# EasyEDA Pro project CANBUSdataLoggerProjectFile.epro

# Schematic Schematic1
Board Name: Board1; Create Date: 2025-11-18; Page Name: P1; Project Name: carInfoDisplay; Schematic Name: Schematic1; Update Date: 2025-11-19; Company: EasyEDA.com; Page Size: A4; Version: V1.0
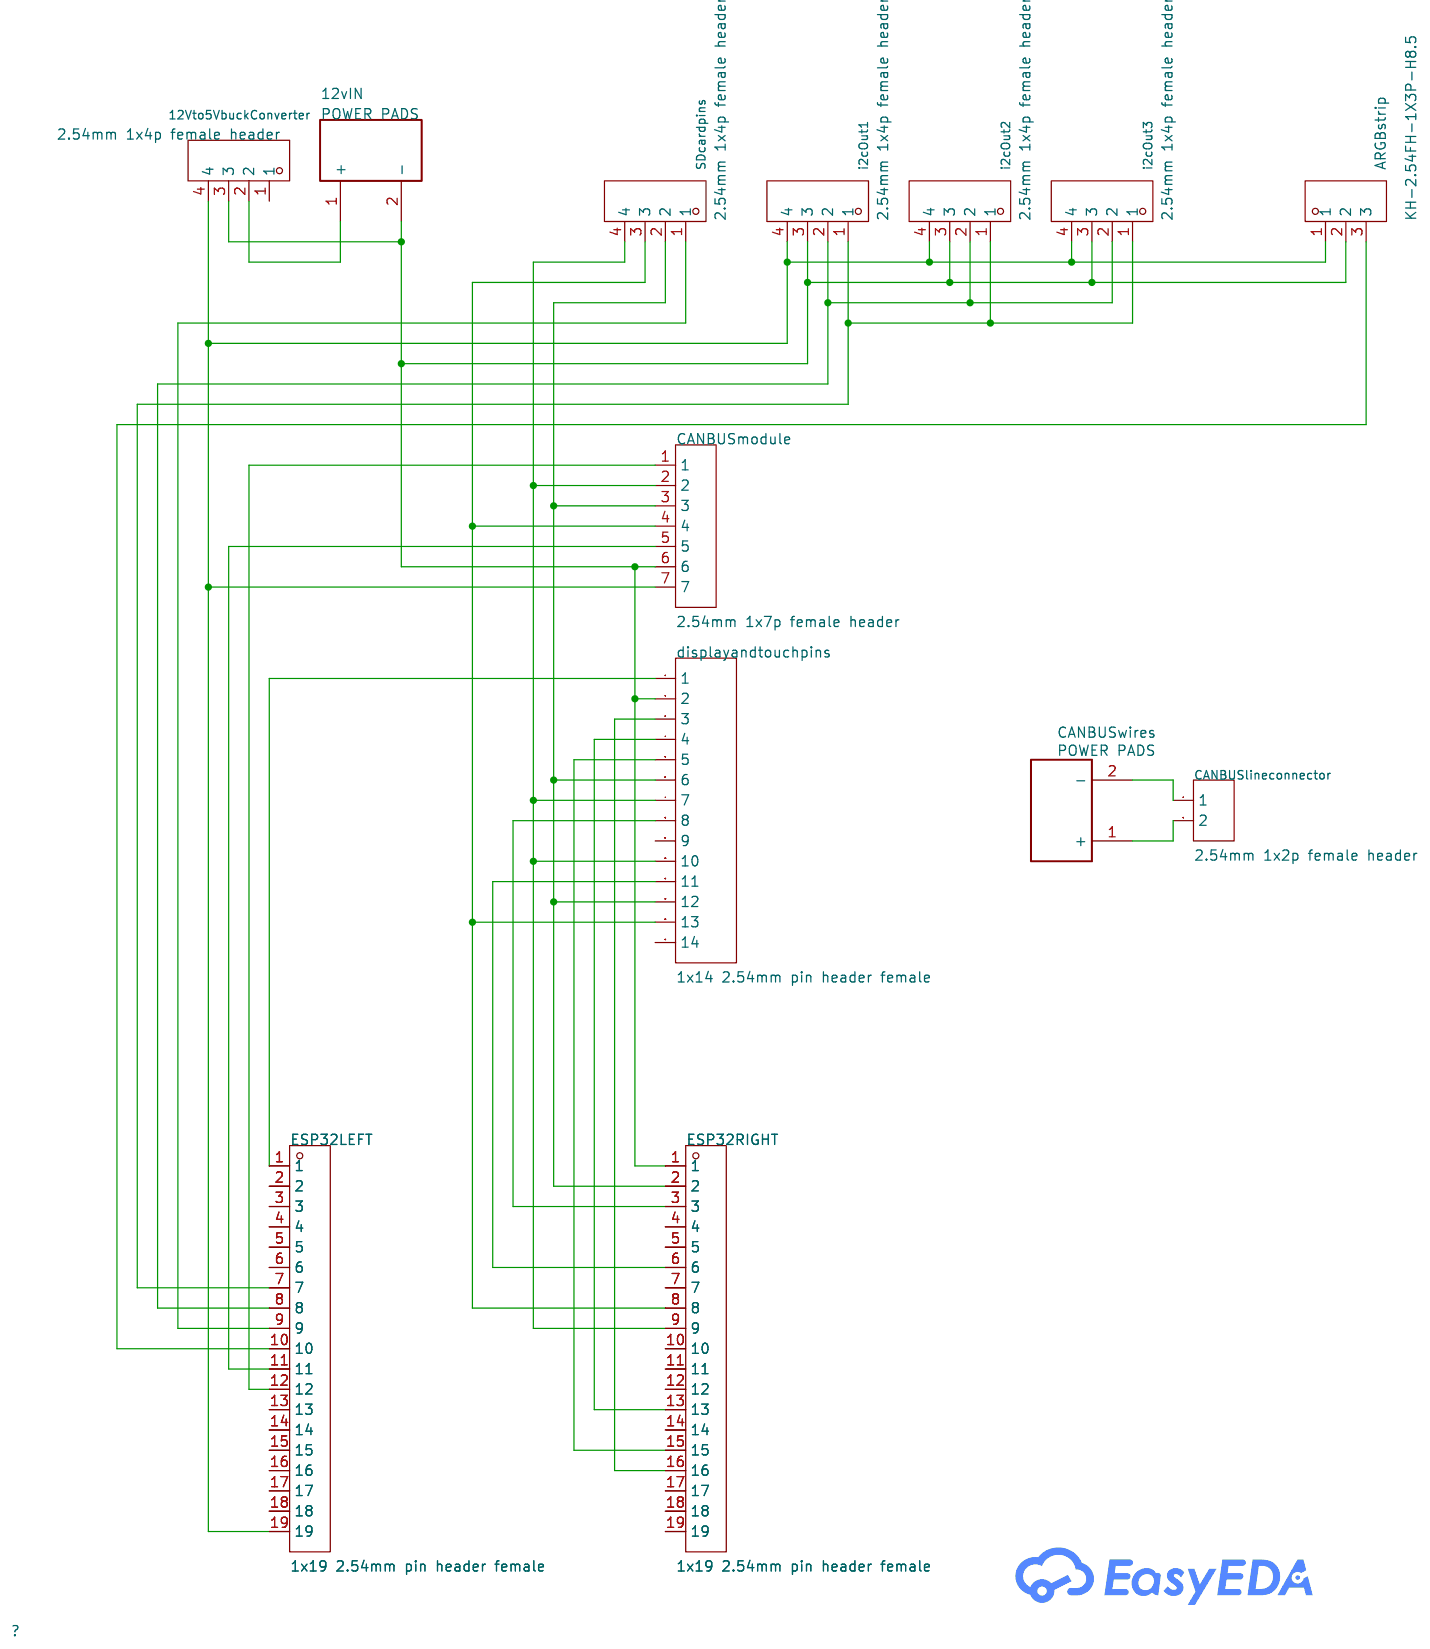
[diagram p0: schematic sheet]

## Parts
12vIN  POWER PADS  [POWERPADS]
12Vto5VbuckConverter  2.54mm 1x4p female header  [HDR-TH_4P-P2.54-V-F]
ARGBstrip  KH-2.54FH-1X3P-H8.5  [HDR-TH_3P-P2.54-V-F]
CANBUSlineconnector  2.54mm 1x2p female header  [HDR-TH_2P-P2.54-V-F]
CANBUSmodule  2.54mm 1x7p female header  [HDR-TH_7P-P2.54-V-F]
CANBUSwires  POWER PADS  [POWERPADS]
displayandtouchpins  1x14 2.54mm pin header female  [HDR-TH_14P-P2.54-V-F-1]
ESP32LEFT  1x19 2.54mm pin header female  [HDR-TH_19P-P2.54-V-F]
ESP32RIGHT  1x19 2.54mm pin header female  [HDR-TH_19P-P2.54-V-F]
i2cOut1  2.54mm 1x4p female header  [HDR-TH_4P-P2.54-V-F]
i2cOut2  2.54mm 1x4p female header  [HDR-TH_4P-P2.54-V-F]
i2cOut3  2.54mm 1x4p female header  [HDR-TH_4P-P2.54-V-F]
SDcardpins  2.54mm 1x4p female header  [HDR-TH_4P-P2.54-V-F]

## Library data of the parts
12vIN CANBUSwires = POWER PADS: Contributor: tomicode; spicePre: P
12Vto5VbuckConverter i2cOut1-i2cOut3 SDcardpins = 2.54-1*4P母: Holes Structure:1x4P Pitch:2.54mm Row Spacing:- Circular Hole / Square Hole:Square Hole Mounting Type:Through Hole Number of Rows:1 Number of Positions:4P Current Rating:3A Voltage Rating (Max):- Holes Direction:Top Insulation Height:- Contact Material:Br; LCSC Part Name: 间距:2.54mm 1x4P 直插; Supplier Part: C2718488; Manufacturer: BOOMELE(博穆精密); Supplier Footprint: 插件,P=2.54mm; JLCPCB Part Class: Extended Part; Datasheet: https://item.szlcsc.com/datasheet/2.54-1*4P%25E6%25AF%258D/2834502.html; Supplier: LCSC; Holes Structure: 1x4P; Pitch: 2.54mm; Circular Hole / Square Hole: Square Hole; Mounting Type: Through Hole; Number of Rows: 1; Number of Positions: 4P; Current Rating: 3A; Holes Direction: Top; Contact Material: Bronze; Operating Temperature: -40℃~+105℃
ARGBstrip = KH-2.54FH-1X3P-H8.5: Holes Structure:1x3P Pitch:2.54mm Row Spacing:- Circular Hole / Square Hole:Square Hole Mounting Type:Through Hole Number of Rows:1 Number of Positions:3P Current Rating:3A Voltage Rating (Max):- Holes Direction:Top Insulation Height:8.5mm Operating Tempe; LCSC Part Name: 间距:2.54mm 1x3P 直插; Supplier Part: C2932670; Manufacturer: kinghelm(金航标); Supplier Footprint: 插件,P=2.54mm; JLCPCB Part Class: Extended Part; Datasheet: https://item.szlcsc.com/datasheet/KH-2.54FH-1X3P-H8.5/3278191.html; Supplier: LCSC; Holes Structure: 1x3P; Pitch: 2.54mm; Circular Hole / Square Hole: Square Hole; Mounting Type: Through Hole; Number of Rows: 1; Number of Positions: 3P; Current Rating: 3A; Holes Direction: Top; Insulation Height: 8.5mm; Operating Temperature: -40℃~+105℃
CANBUSlineconnector = 2.54-1*2P母: Holes Structure:1x2P Pitch:2.54mm Row Spacing:- Circular Hole / Square Hole:Square Hole Mounting Type:Through Hole Number of Rows:1 Number of Positions:2P Current Rating:3A Holes Direction:Top Insulation Height:3.3mm Contact Material:- Contact Plating:- O; LCSC Part Name: 1x2P 间距:2.54mm 直插; Supplier Part: C49661; Manufacturer: BOOMELE(博穆精密); Supplier Footprint: 插件,P=2.54mm; JLCPCB Part Class: Extended Part; Datasheet: https://item.szlcsc.com/datasheet/2.54-1*2P%25E6%25AF%258D/50669.html; Supplier: LCSC; Holes Structure: 1x2P; Pitch: 2.54mm; Circular Hole / Square Hole: Square Hole; Mounting Type: Through Hole; Number of Rows: 1; Number of Positions: 2P; Current Rating: 3A; Holes Direction: Top; Insulation Height: 3.3mm; Operating Temperature: -40℃~+105℃
CANBUSmodule = HC-PM254-8.5H-1x7PZ: Holes Structure:1x7P Pitch:2.54mm Row Spacing:- Circular Hole / Square Hole:Square Hole Mounting Type:Through Hole Number of Rows:1 Number of Positions:7P Current Rating:3A Voltage Rating (Max):- Holes Direction:Top Insulation Height:8.5mm Contact Materia; LCSC Part Name: 间距2.54mm 1x7Pin 直插 PC3.0 H8.5; Supplier Part: C22373893; Manufacturer: HC(虹成电子); Supplier Footprint: 插件,P=2.54mm; JLCPCB Part Class: Extended Part; Datasheet: https://item.szlcsc.com/datasheet/HC-PM254-8.5H-1x7PZ/23870229.html; Supplier: LCSC; Holes Structure: 1x7P; Pitch: 2.54mm; Circular Hole / Square Hole: Square Hole; Mounting Type: Through Hole; Number of Rows: 1; Number of Positions: 7P; Current Rating: 3A; Holes Direction: Top; Insulation Height: 8.5mm; Contact Material: Brass; Contact Plating: Gold; Operating Temperature: -40℃~+105℃; PIN Length: 3mm
displayandtouchpins = 2.54-1*14P母: Holes Structure:1x14P Pitch:2.54mm Row Spacing:- Circular Hole / Square Hole:Square Hole Mounting Type:Through Hole Number of Rows:1 Number of Positions:14P Current Rating:3A Voltage Rating (Max):- Holes Direction:Top Insulation Height:3.3mm Contact Mater; LCSC Part Name: 1x14P 间距:2.54mm 直插; Supplier Part: C52711; Manufacturer: BOOMELE(博穆精密); Supplier Footprint: 插件,P=2.54mm; JLCPCB Part Class: Extended Part; Datasheet: https://item.szlcsc.com/datasheet/2.54-1*14P%25E6%25AF%258D/53725.html; Supplier: LCSC; Holes Structure: 1x14P; Pitch: 2.54mm; Circular Hole / Square Hole: Square Hole; Mounting Type: Through Hole; Number of Rows: 1; Number of Positions: 14P; Current Rating: 3A; Holes Direction: Top; Insulation Height: 3.3mm; Operating Temperature: -40℃~+105℃
ESP32LEFT ESP32RIGHT = KH-2.54FH-1X19P-H8.5: Holes Structure:1x19P Pitch:2.54mm Row Spacing:- Circular Hole / Square Hole:Square Hole Mounting Type:Through Hole Number of Rows:1 Number of Positions:19P Current Rating:3A Voltage Rating (Max):- Holes Direction:Top Insulation Height:8.5mm Operating Tem; LCSC Part Name: 间距:2.54mm 1x19P 直插; Supplier Part: C2932678; Manufacturer: kinghelm(金航标); Supplier Footprint: 插件,P=2.54mm; JLCPCB Part Class: Extended Part; Datasheet: https://item.szlcsc.com/datasheet/KH-2.54FH-1X19P-H8.5/3278199.html; Supplier: LCSC; Holes Structure: 1x19P; Pitch: 2.54mm; Circular Hole / Square Hole: Square Hole; Mounting Type: Through Hole; Number of Rows: 1; Number of Positions: 19P; Current Rating: 3A; Holes Direction: Top; Insulation Height: 8.5mm; Operating Temperature: -40℃~+105℃

## Nets
$1N1624: displayandtouchpins.1 ESP32LEFT.1
$1N1629: 12vIN.2(-) 12Vto5VbuckConverter.3 ARGBstrip.2 CANBUSmodule.6 displayandtouchpins.2 ESP32RIGHT.1 i2cOut1.3 i2cOut2.3 i2cOut3.3
$1N1636: displayandtouchpins.3 ESP32RIGHT.16
$1N1643: displayandtouchpins.4 ESP32RIGHT.13
$1N1650: displayandtouchpins.5 ESP32RIGHT.15
$1N1657: CANBUSmodule.3 displayandtouchpins.6 displayandtouchpins.12 ESP32RIGHT.2 SDcardpins.2
$1N1663: CANBUSmodule.2 displayandtouchpins.7 displayandtouchpins.10 ESP32RIGHT.9 SDcardpins.4
$1N1670: displayandtouchpins.8 ESP32RIGHT.3
$1N1691: displayandtouchpins.11 ESP32RIGHT.6
$1N1709: CANBUSmodule.4 displayandtouchpins.13 ESP32RIGHT.8 SDcardpins.3
$1N1824: CANBUSmodule.1 ESP32LEFT.12
$1N1870: CANBUSmodule.5 ESP32LEFT.11
$1N1888: 12Vto5VbuckConverter.4 ARGBstrip.1 CANBUSmodule.7 ESP32LEFT.19 i2cOut1.4 i2cOut2.4 i2cOut3.4
$1N1979: CANBUSlineconnector.2 CANBUSwires.1(+)
$1N1984: CANBUSlineconnector.1 CANBUSwires.2(-)
$1N2085: 12vIN.1(+) 12Vto5VbuckConverter.2
$1N2121: ESP32LEFT.9 SDcardpins.1
$1N2367: ESP32LEFT.8 i2cOut1.2 i2cOut2.2 i2cOut3.2
$1N2374: ESP32LEFT.7 i2cOut1.1 i2cOut2.1 i2cOut3.1
$1N3081: ARGBstrip.3 ESP32LEFT.10

Not connected (* = marked no-connect by the designer): 12Vto5VbuckConverter 1; displayandtouchpins 9 14; ESP32LEFT 2 3 4 5 6 13 14 15 16 17 18; ESP32RIGHT 4 5 7 10 11 12 14 17 18 19

# Board PCB1
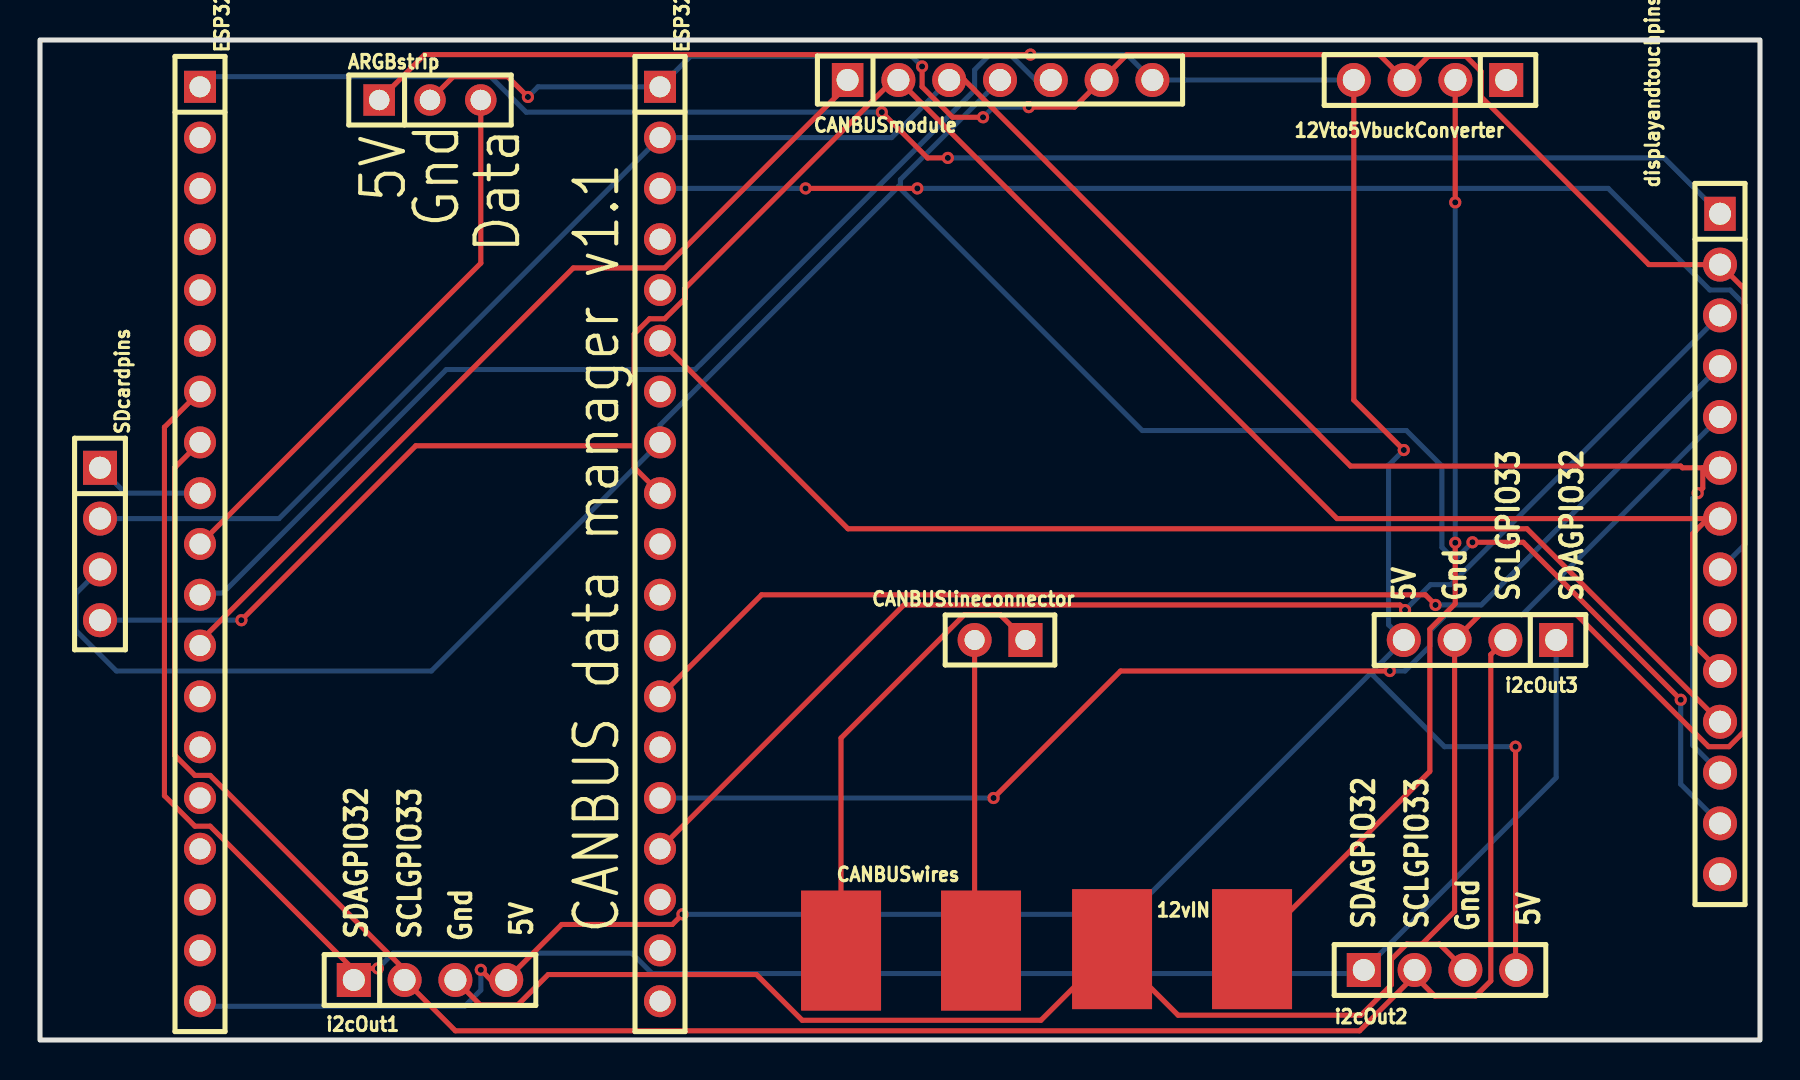
[diagram p1: board, top side]
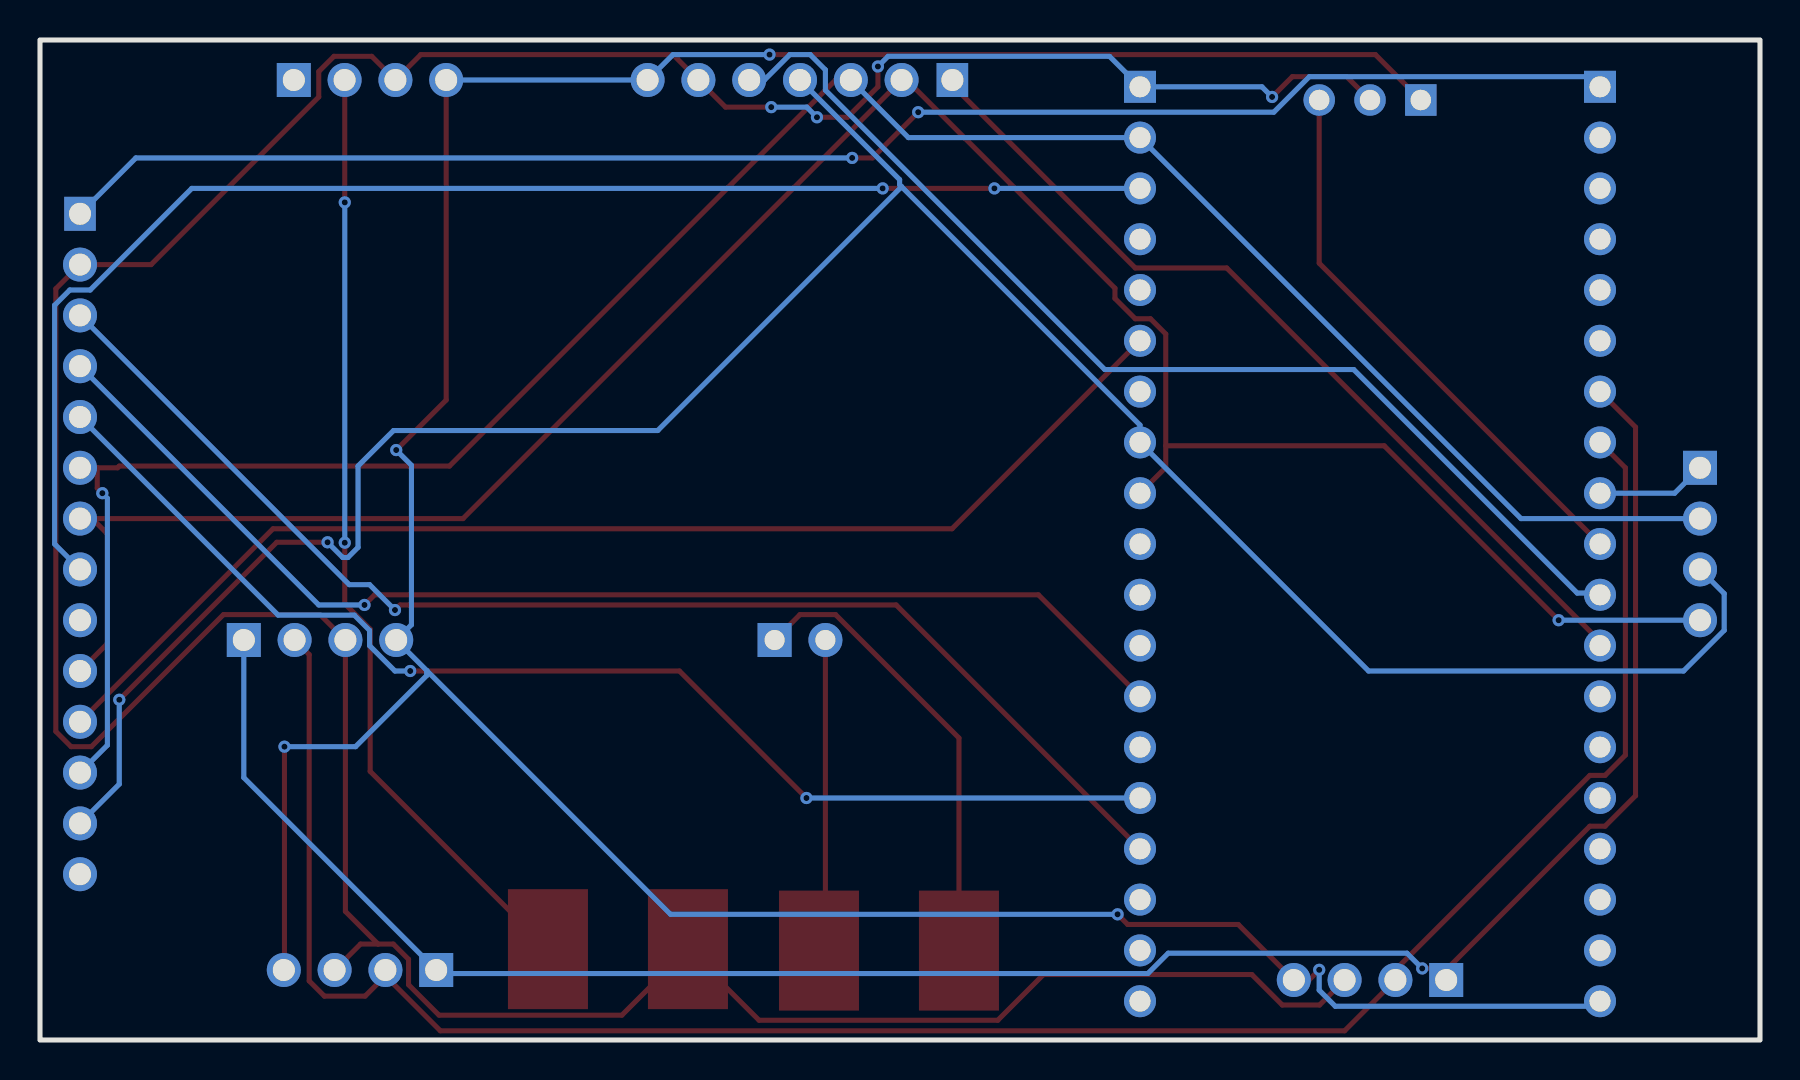
[diagram p2: board, bottom side, seen from below]

Outline 86 x 50 mm; copper layers: Top Layer, Bottom Layer. Coordinates in mm from the lower left corner of the outline.
Outline path: rectangle 0,50 86,0
Stack: Top Layer 0.035mm / Dielectric1 1.51mm FR4 er 4.5 / Bottom Layer 0.035mm

## Design rules (mm)
template: JLCPCB Capability(Two Layers Board)
spacing copperThickness1oz (default): track to track 0.102, other pairs 0.152 to 0.3
spacing copperThickness2oz: track to track 0.203, other pairs 0.152 to 0.3
track width copperThickness1oz (default): min 0.127, default 0.254, max 2.54
track width copperThickness2oz: min 0.203, default 0.254, max 2.54
differential pair differentialPair (default): width min 0.127, default 0.254, max 2.54; gap min 0.152, default 0.152
via viaSize (default): diameter min 0.5, default 0.61, max 10; hole min 0.3, default 0.305, max 6.3

## Placement (name value [footprint] x y rotation side)
12vIN  POWER PADS  [POWERPADS]  60.54 4.39 90 top
12Vto5VbuckConverter  2.54mm 1x4p female header  [HDR-TH_4P-P2.54-V-F]  69.5 48 180 top
ARGBstrip  KH-2.54FH-1X3P-H8.5  [HDR-TH_3P-P2.54-V-F]  19.5 47 0 top
CANBUSlineconnector  2.54mm 1x2p female header  [HDR-TH_2P-P2.54-V-F]  48 20 180 top
CANBUSmodule  2.54mm 1x7p female header  [HDR-TH_7P-P2.54-V-F]  48 48 0 top
CANBUSwires  POWER PADS  [POWERPADS]  46.99 4.32 90 top
displayandtouchpins  1x14 2.54mm pin header female  [HDR-TH_14P-P2.54-V-F-1]  84 24.8 270 top
ESP32LEFT  1x19 2.54mm pin header female  [HDR-TH_19P-P2.54-V-F]  8 24.8 270 top
ESP32RIGHT  1x19 2.54mm pin header female  [HDR-TH_19P-P2.54-V-F]  31 24.8 270 top
i2cOut1  2.54mm 1x4p female header  [HDR-TH_4P-P2.54-V-F]  19.5 3 0 top
i2cOut2  2.54mm 1x4p female header  [HDR-TH_4P-P2.54-V-F]  70 3.5 0 top
i2cOut3  2.54mm 1x4p female header  [HDR-TH_4P-P2.54-V-F]  72 20 180 top
SDcardpins  2.54mm 1x4p female header  [HDR-TH_4P-P2.54-V-F]  3 24.8 270 top

## Footprints (pads in the part's own frame, mm; a bottom-side part is the same pattern mirrored in y, then rotated)
HDR-TH_2P-P2.54-V-F
  rect 1.7x1.7 hole 1: 1(-1.27,0)
  round 1.7 hole 1: 2(1.27,0)
HDR-TH_3P-P2.54-V-F
  rect 1.575x1.575 hole 1.02: 1(-2.54,0)
  round 1.575 hole 1.02: 2(0,0) 3(2.54,0)
HDR-TH_4P-P2.54-V-F
  rect 1.7x1.7 hole 1.1: 1(-3.81,0)
  round 1.7 hole 1.1: 2(-1.27,0) 3(1.27,0) 4(3.81,0)
HDR-TH_7P-P2.54-V-F
  rect 1.575x1.7 hole 1.1: 1(-7.62,0)
  round 1.7 hole 1.1: 2(-5.08,0) 3(-2.54,0) 4(0,0) 5(2.54,0) 6(5.08,0) 7(7.62,0)
HDR-TH_14P-P2.54-V-F-1
  rect 1.7x1.575 hole 1.1: 1(-16.51,0)
  round 1.7 hole 1.1: 2(-13.97,0) 3(-11.43,0) 4(-8.89,0) 5(-6.35,0) 6(-3.81,0) 7(-1.27,0) 8(1.27,0) 9(3.81,0) 10(6.35,0) 11(8.89,0) 12(11.43,0) 13(13.97,0) 14(16.51,0)
HDR-TH_19P-P2.54-V-F
  rect 1.6x1.6 hole 1.05: 1(-22.86,0)
  round 1.6 hole 1.05: 2(-20.32,0) 3(-17.78,0) 4(-15.24,0) 5(-12.7,0) 6(-10.16,0) 7(-7.62,0) 8(-5.08,0) 9(-2.54,0) 10(0,0) 11(2.54,0) 12(5.08,0) 13(7.62,0) 14(10.16,0) 15(12.7,0) 16(15.24,0) 17(17.78,0) 18(20.32,0) 19(22.86,0)
POWERPADS
  rect 6x4 smd: 1(0.152,-0.06) 2(0.152,6.939)

## Nets
As in the schematic.

Pads without a net: 12Vto5VbuckConverter 1; displayandtouchpins 9 14; ESP32LEFT 2 3 4 5 6 13 14 15 16 17 18; ESP32RIGHT 4 5 7 10 11 12 14 17 18 19

## Via types
v1: diameter 0.61, hole 0.305, Top Layer to Bottom Layer, 24 vias

## Routing (per net, layer and track width the routed paths; a pad name or vN(x,y) marks a point on that pad's centre or on a via; arc(x,y) is an arc through that point)
$1N1624: length 79.1
  Top Layer w0.254: v1(42.09,46.39) 44.38,44.1 v1(45.39,44.1)
  Bottom Layer w0.254: v1(45.39,44.1) 81.21,44.1 displayandtouchpins.1 ; v1(42.09,46.39) 24.31,46.39 22.53,48.17 8.51,48.17 ESP32LEFT.1
$1N1629: length 191.4
  Top Layer w0.254: i2cOut1.3 22.02,1.75 23.88,1.75 25.41,3.27 35.82,3.27 38.11,0.99 50.05,0.99 53.6,4.54 56.9,1.24 66.05,1.24 67.57,2.77 67.57,4.03 68.33,4.8 69.1,4.8 ; v1(47.15,46.14) 45.63,46.14 44.1,47.66 v1(44.1,48.68) ; 69.1,4.8 69.97,4.8 i2cOut2.3 ; 69.1,4.8 70.73,6.43 i2cOut3.3 72,21.27 76.83,21.27 83.43,14.67 84.45,14.67 85.21,15.43 85.21,37.56 displayandtouchpins.2 80.44,38.77 72.06,47.15 72.06,48.42 71.3,49.18 69.41,49.18 12Vto5VbuckConverter.3 66.96,49.27 54.35,49.27 CANBUSmodule.6 51.72,46.64 v1(49.44,46.64) ; ARGBstrip.2 20.67,48.17 23.38,48.17 v1(24.4,47.15)
  Bottom Layer w0.254: v1(49.44,46.64) 47.66,46.64 v1(47.15,46.14) ; v1(24.4,47.15) 24.9,47.66 ESP32RIGHT.1 32.52,49.18 43.6,49.18 v1(44.1,48.68)
$1N1636: length 64.3
  Top Layer w0.254: ESP32RIGHT.16 43.19,21.75 68,21.75 v1(68.25,21.5)
  Bottom Layer w0.254: v1(68.25,21.5) 69.52,22.77 70.54,22.77 displayandtouchpins.3
$1N1643: length 60.3
  Top Layer w0.254: v1(69.78,21.75) 69.27,22.26 36.08,22.26 ESP32RIGHT.13
  Bottom Layer w0.254: v1(69.78,21.75) 72.06,21.75 displayandtouchpins.4
$1N1650: length 61.3
  Top Layer w0.254: v1(47.68,12.1) 54.03,18.45 v1(67.49,18.45)
  Bottom Layer w0.254: displayandtouchpins.5 74.09,21.24 70.28,21.24 69.52,20.48 69.52,19.72 68.25,18.45 v1(67.49,18.45) ; v1(47.68,12.1) ESP32RIGHT.15
$1N1657: length 114.1
  Top Layer w0.254: 83.14,28.61 displayandtouchpins.6 ; 83.14,28.61 83.14,27.59 v1(82.88,27.34) ; 83.14,28.61 82.12,28.61 82.04,28.7 65.53,28.7 46.22,48 CANBUSmodule.3
  Bottom Layer w0.254: SDcardpins.2 11.95,26.07 ESP32RIGHT.2 42.58,45.12 CANBUSmodule.3 ; displayandtouchpins.12 82.63,14.74 82.63,27.09 v1(82.88,27.34)
$1N1663: length 116.3
  Top Layer w0.254: 29.71,29.71 29.71,28.63 ESP32RIGHT.9 ; 29.71,29.71 18.79,29.71 v1(10.07,20.99) ; 29.71,29.71 29.71,35.3 30.47,36.06 31.24,36.06 32.25,37.08 32.25,37.59 42.67,48 CANBUSmodule.2 64.85,26.07 83.39,26.07 ; displayandtouchpins.10 82.63,19.82 82.63,25.31 83.39,26.07 ; 83.39,26.07 displayandtouchpins.7
  Bottom Layer w0.254: v1(10.07,20.99) SDcardpins.4
$1N1670: length 70.4
  Top Layer w0.254: v1(43.87,42.58) v1(38.28,42.58)
  Bottom Layer w0.254: displayandtouchpins.8 85.27,24.8 85.27,36.74 84.51,37.5 83.49,37.5 78.41,42.58 v1(43.87,42.58) ; v1(38.28,42.58) ESP32RIGHT.3
$1N1691: length 60.9
  Top Layer w0.254: displayandtouchpins.11 74.35,25.56 40.4,25.56 ESP32RIGHT.6
$1N1709: length 123.2
  Top Layer w0.254: v1(71.62,24.89) 74.16,24.89 v1(82.04,17.01)
  Bottom Layer w0.254: 42.92,42.67 31,30.75 ESP32RIGHT.8 19.57,18.45 3.82,18.45 1.79,20.48 1.79,22.32 SDcardpins.3 ; 42.92,42.67 55.11,30.47 68.32,30.47 70.1,28.7 70.1,24.63 70.61,24.12 70.86,24.12 v1(71.62,24.89) ; 42.92,42.67 43.02,42.77 43.02,43.02 CANBUSmodule.4 ; displayandtouchpins.13 82.04,12.79 v1(82.04,17.01)
$1N1824: length 44.4
  Top Layer w0.254: ESP32LEFT.12 8,19.94 26.66,38.6 31.24,38.6 40.38,47.75 CANBUSmodule.1
$1N1870: length 54.8
  Bottom Layer w0.254: CANBUSmodule.5 49.78,48 48.51,49.27 47.49,49.27 46.73,48.51 46.73,47.49 32.76,33.52 20.31,33.52 9.14,22.35 8.09,22.35 ESP32LEFT.11
$1N1888: length 168.8
  Top Layer w0.254: v1(68.19,29.5) 65.69,32 12Vto5VbuckConverter.4 ; v1(22.04,3.51) 22.55,3 i2cOut1.4 26.09,5.78 31.61,5.78 v1(32.12,6.28) ; v1(73.78,14.67) 73.78,3.53 i2cOut2.4 ; ARGBstrip.1 19.23,49.27 v1(49.52,49.27)
  Bottom Layer w0.254: 12Vto5VbuckConverter.4 CANBUSmodule.7 54.35,49.27 v1(49.52,49.27) ; v1(22.04,3.51) 22.04,2.49 21.23,1.69 8.25,1.69 ESP32LEFT.19 ; v1(32.12,6.28) 54.47,6.28 66.67,18.48 ; v1(68.19,29.5) 67.43,28.74 67.43,20.76 i2cOut3.4 66.67,18.48 ; 66.67,18.48 66.67,18.22 70.22,14.67 v1(73.78,14.67)
$1N1979: length 15.7
  Top Layer w0.254: CANBUSlineconnector.2 46.73,4.79 CANBUSwires.1
$1N1984: length 22.9
  Top Layer w0.254: CANBUSwires.2 40.05,15.1 46.22,21.27 48,21.27 CANBUSlineconnector.1
$1N2085: length 47.7
  Top Layer w0.254: v1(70.76,24.86) 70.76,21.81 69.49,20.55 69.49,13.43 60.6,4.54 ; 12Vto5VbuckConverter.2 70.76,47.99 v1(70.76,41.88)
  Bottom Layer w0.254: v1(70.76,24.86) v1(70.76,41.88)
$1N2121: length 5.5
  Bottom Layer w0.254: ESP32LEFT.9 4.27,27.34 SDcardpins.1
$1N2367: length 107.5
  Top Layer w0.254: ESP32LEFT.8 6.73,28.61 6.73,14.25 7.75,13.23 8.51,13.23 18.23,3.51 i2cOut1.2 20.77,0.46 65.98,0.46 68.73,3.21 ; 68.73,3.21 69.75,2.19 71.78,2.19 72.54,2.95 72.54,19.27 i2cOut3.2 ; 68.73,3.21 i2cOut2.2
$1N2374: length 106.4
  Top Layer w0.254: 15.62,3.58 15.62,3.07 i2cOut1.1 ; 15.62,3.58 8.51,10.69 7.75,10.69 6.22,12.21 6.22,30.64 ESP32LEFT.7 ; 15.62,3.58 v1(16.89,3.58)
  Bottom Layer w0.254: i2cOut3.1 75.81,13.12 i2cOut2.1 66.01,3.32 30.61,3.32 29.59,4.34 17.65,4.34 v1(16.89,3.58)
$1N3081: length 28
  Top Layer w0.254: ESP32LEFT.10 22.04,38.84 ARGBstrip.3

## Text on the board
Top Silkscreen Layer: 5V | Gnd | SCLGPIO33 | SDAGPIO32 | Data | CANBUS data manager v1.1
